# EasyEDA Pro project 万用表.eprj, schematic Schematic1_2

## Sheets
1 core: Board Name: 1.2版本-小表笔; Create Date: 2025-04-22; Page Name: core; Project Name: 天空星-简易数字万用表拓展版; Schematic Name: Schematic1_2; Update Date: 2025-04-22; Company: 嘉立创EDA; Page Size: A4; Version: V1.0
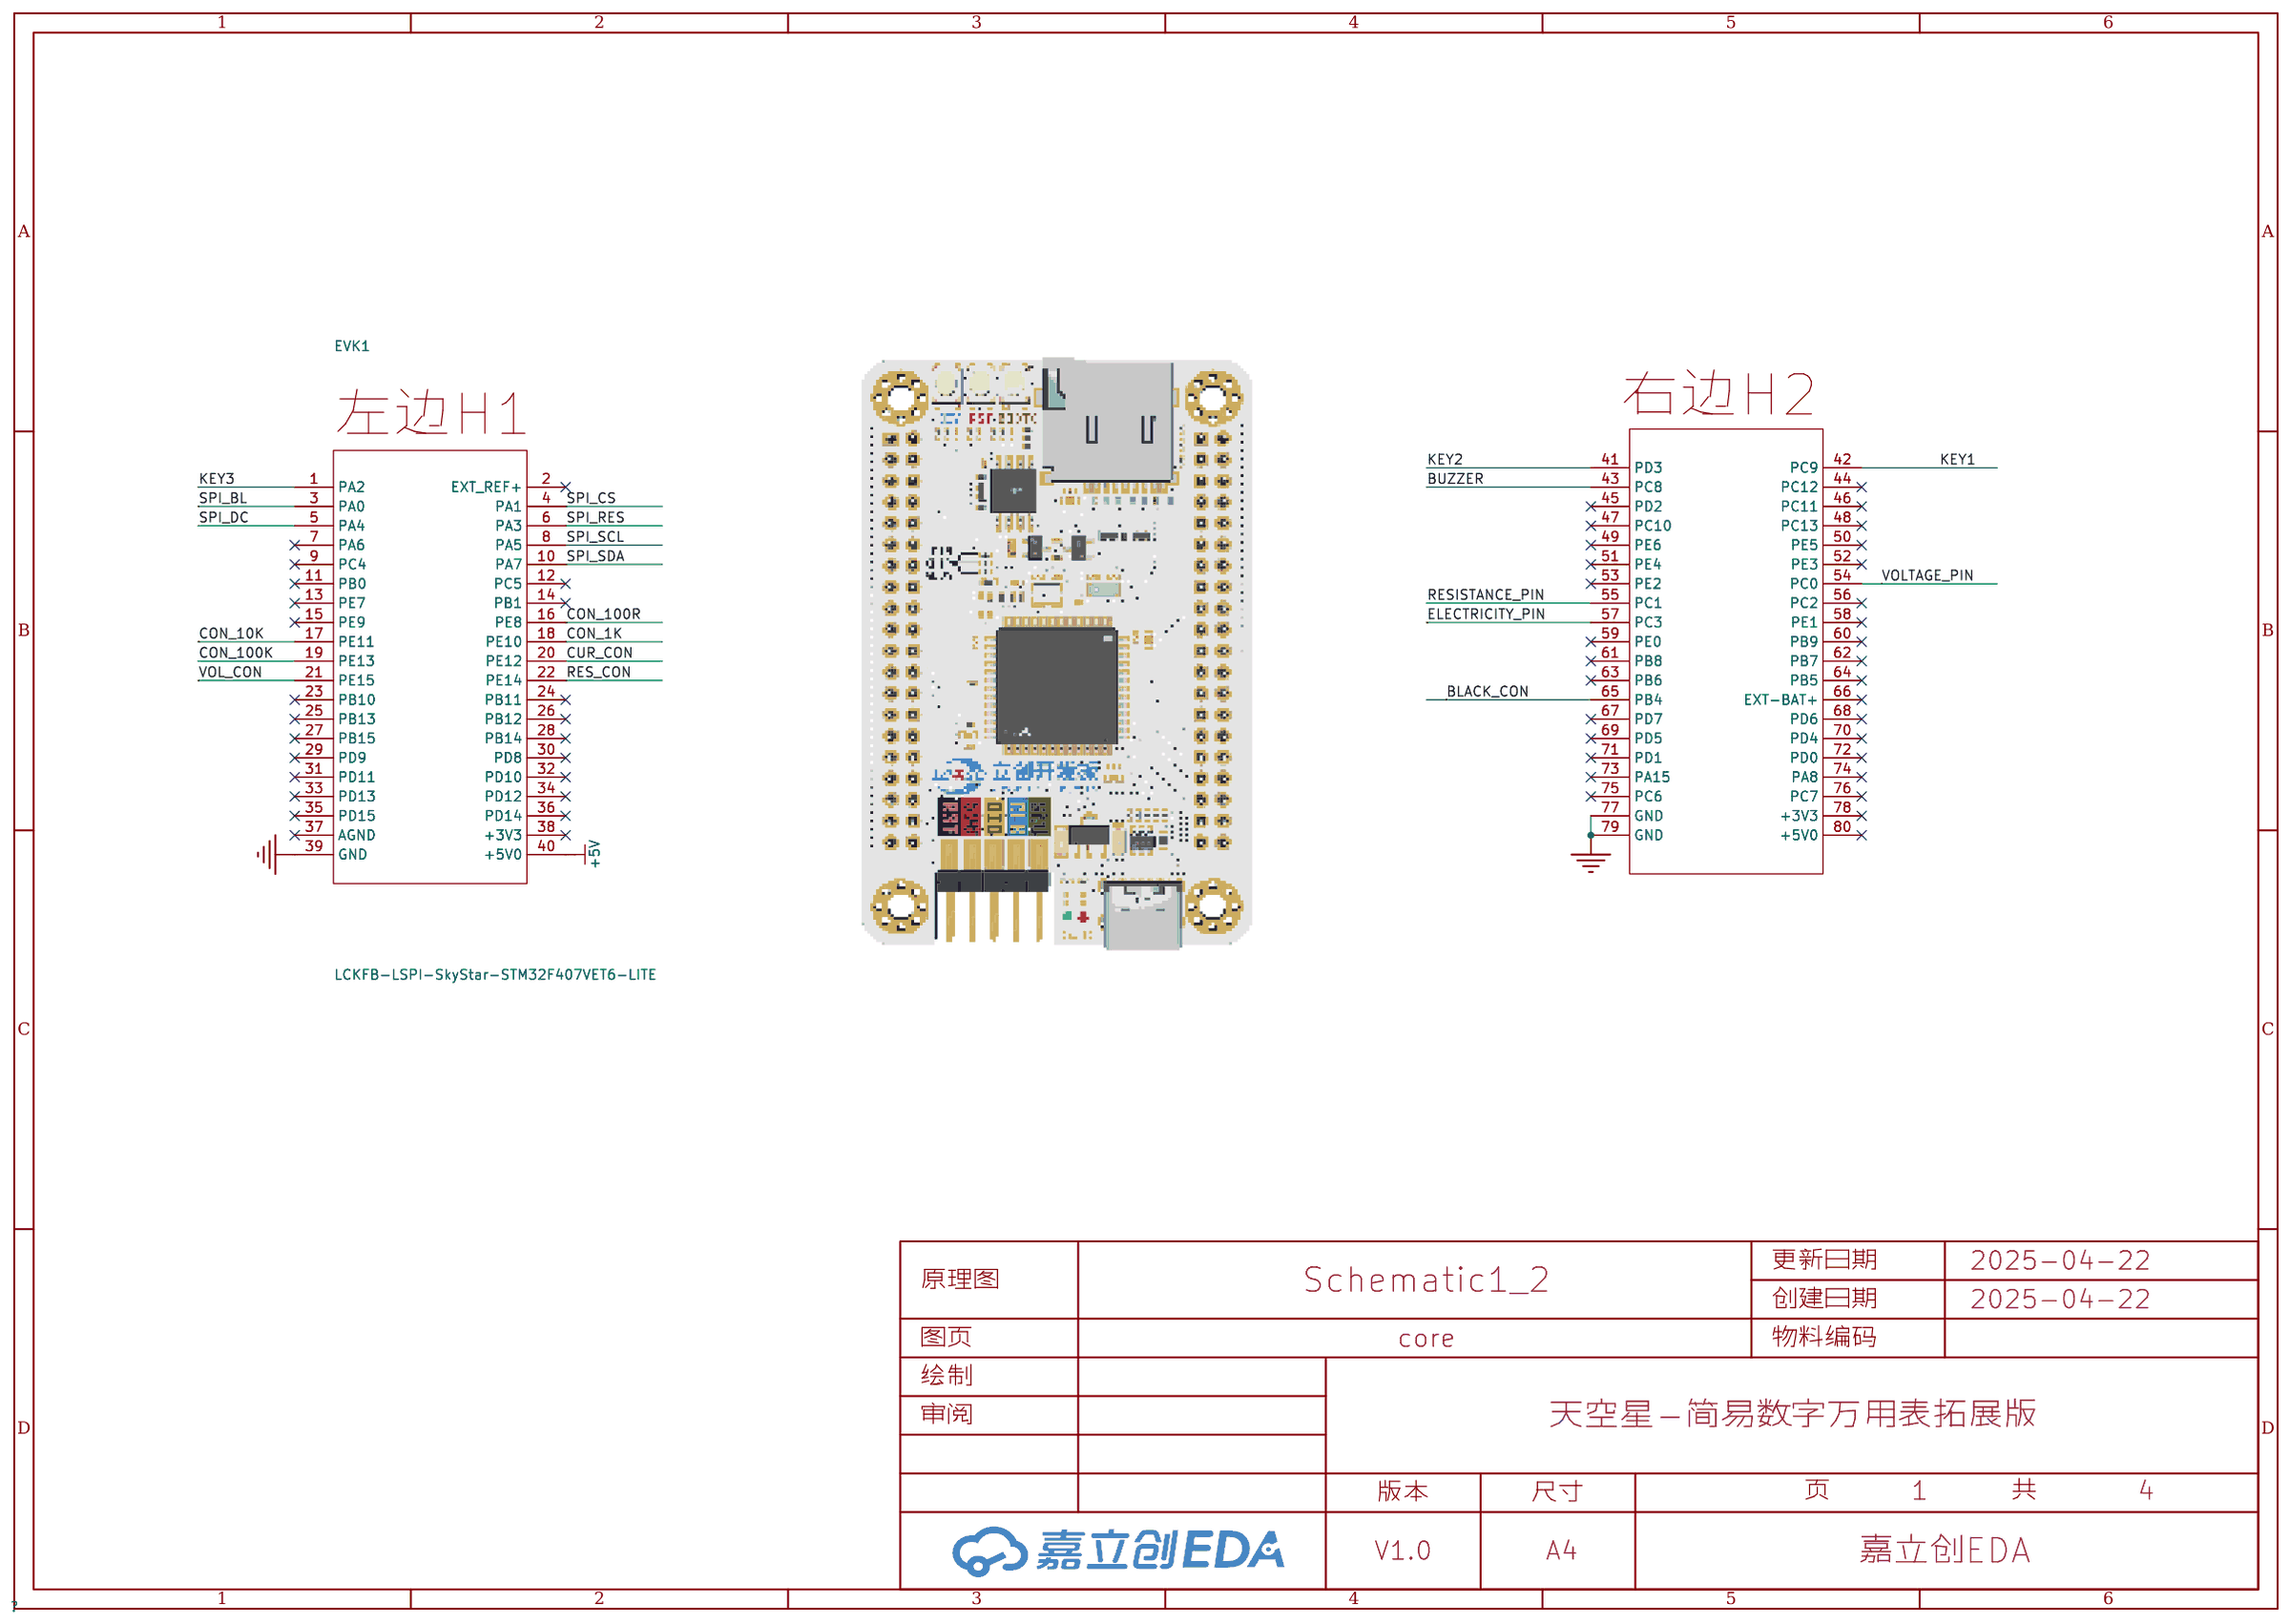
[diagram p4: core]
2 peripheral: Page Name: peripheral
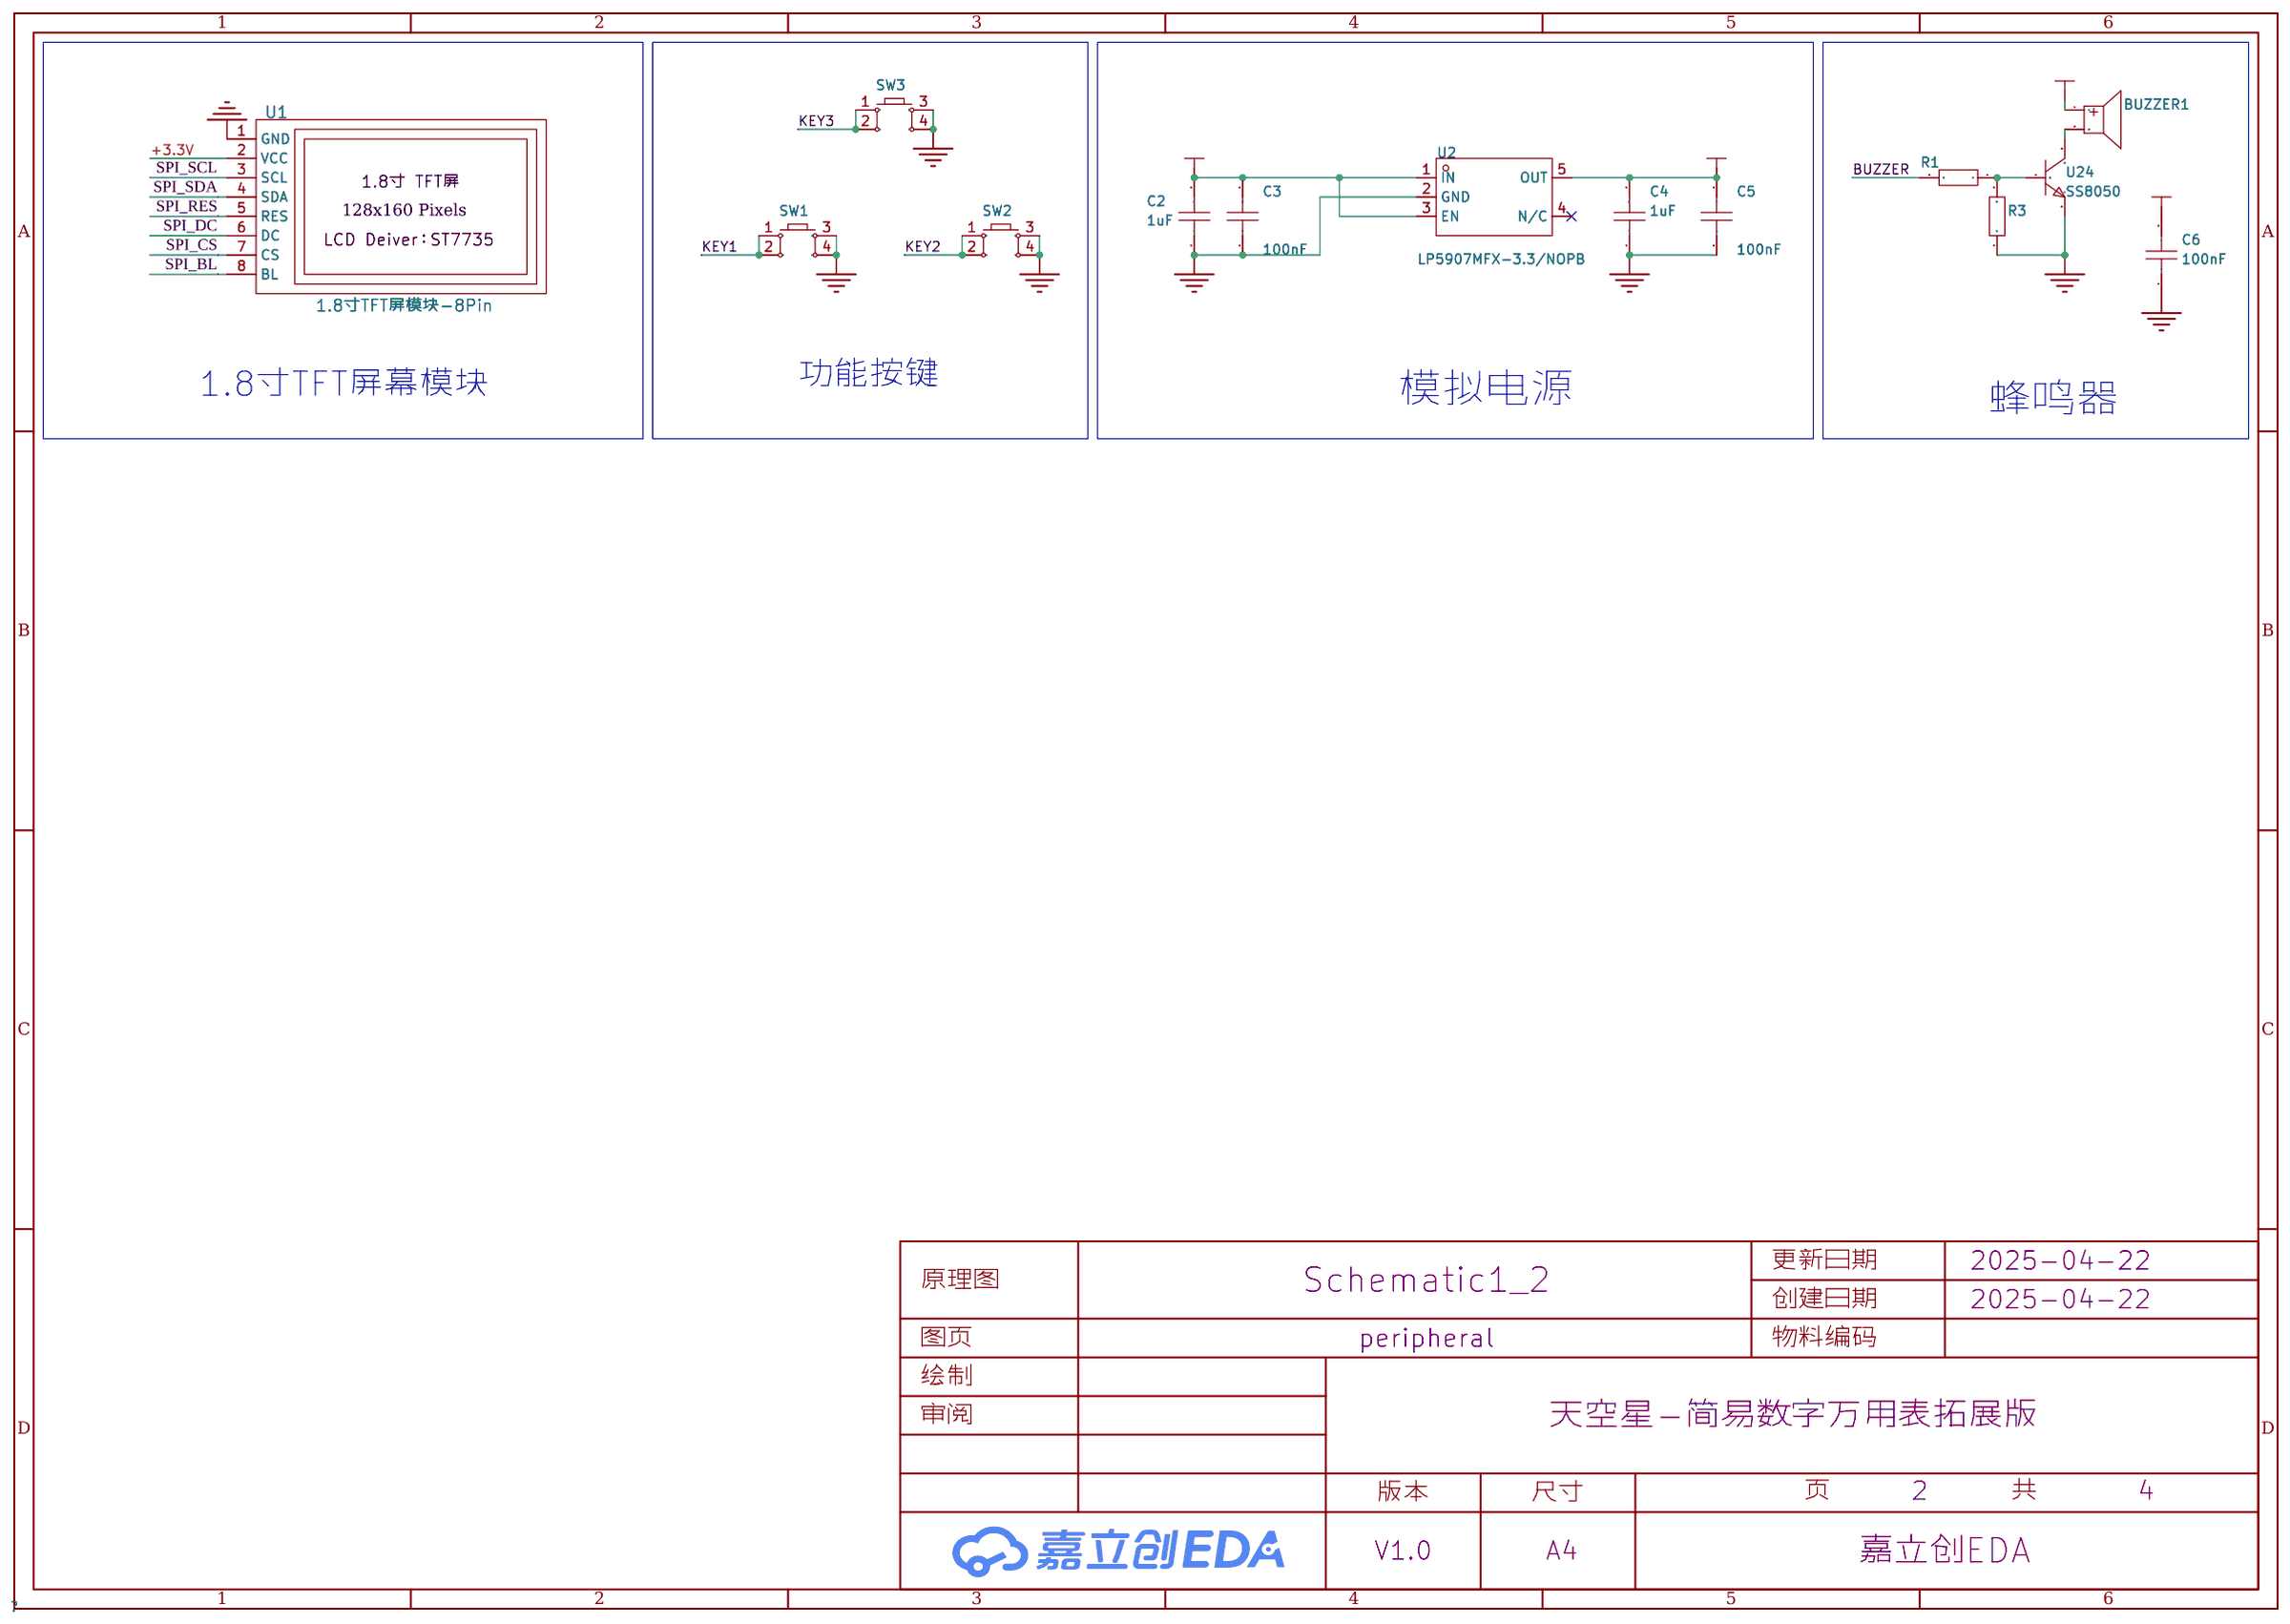
[diagram p5: peripheral]
3 control: Page Name: control
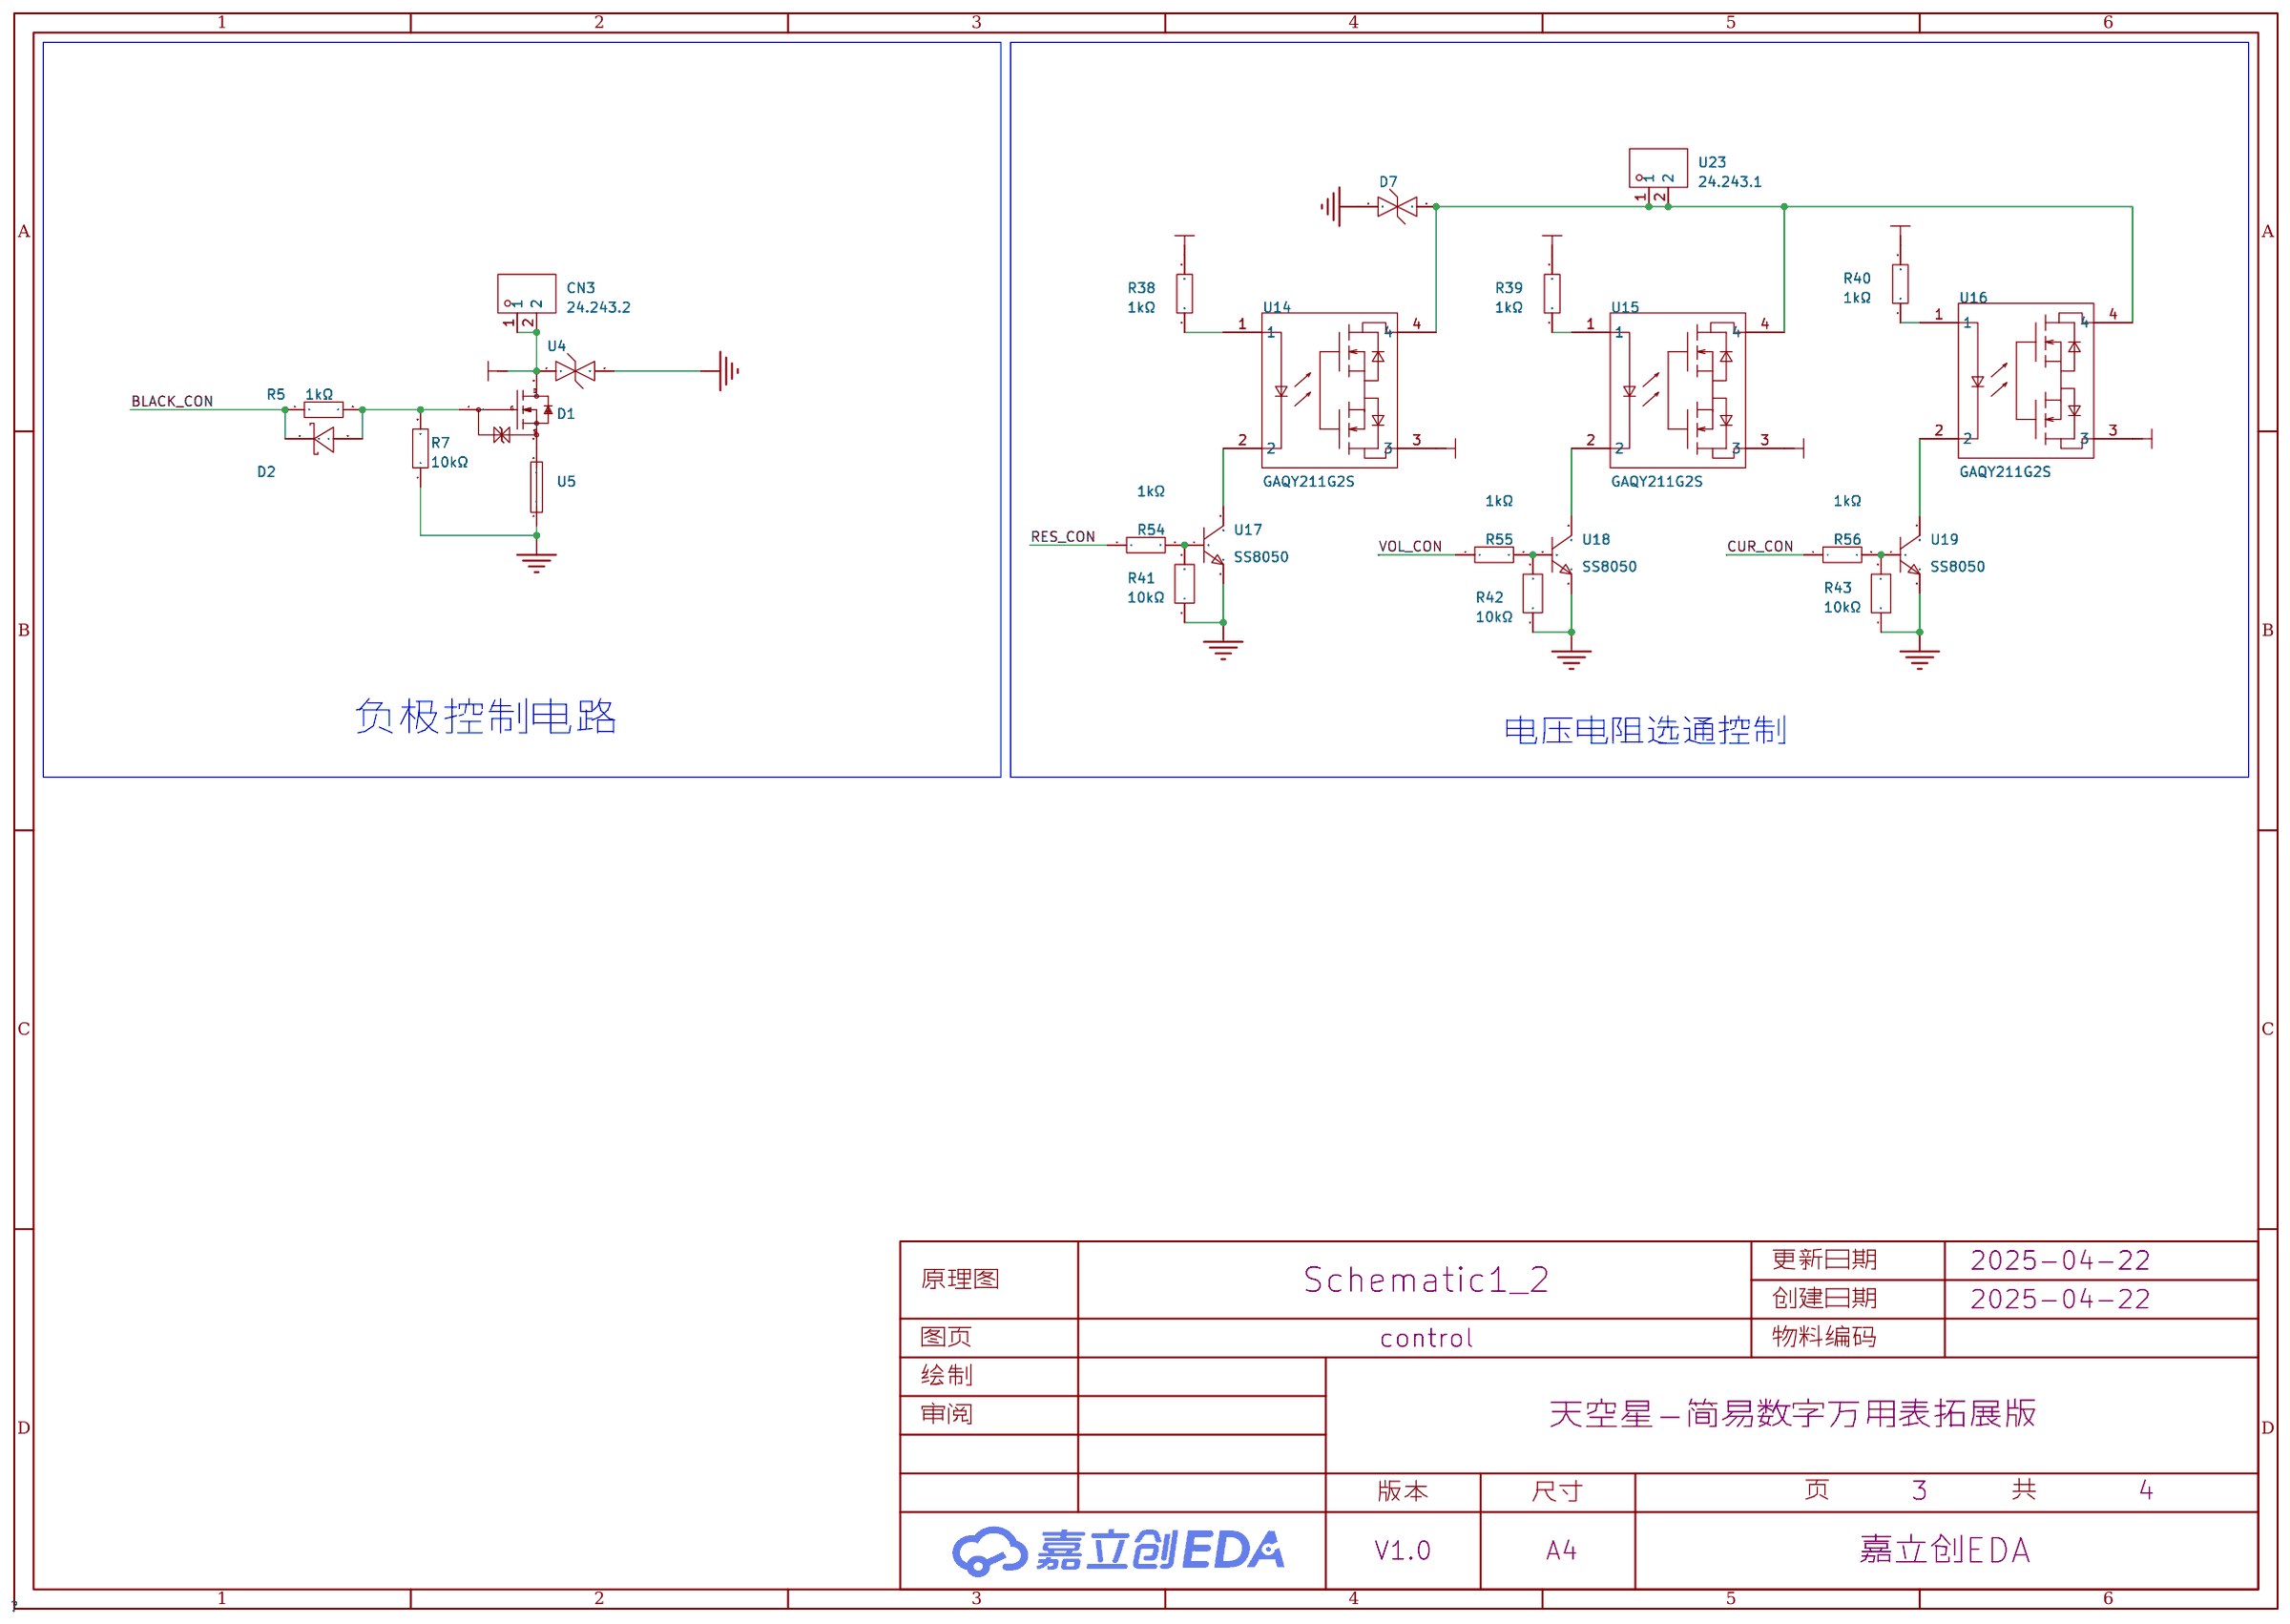
[diagram p6: control]
4 measure: Create Date: 2025-10-28; Page Name: measure; Project Name: 万用表; Update Date: 2025-10-28
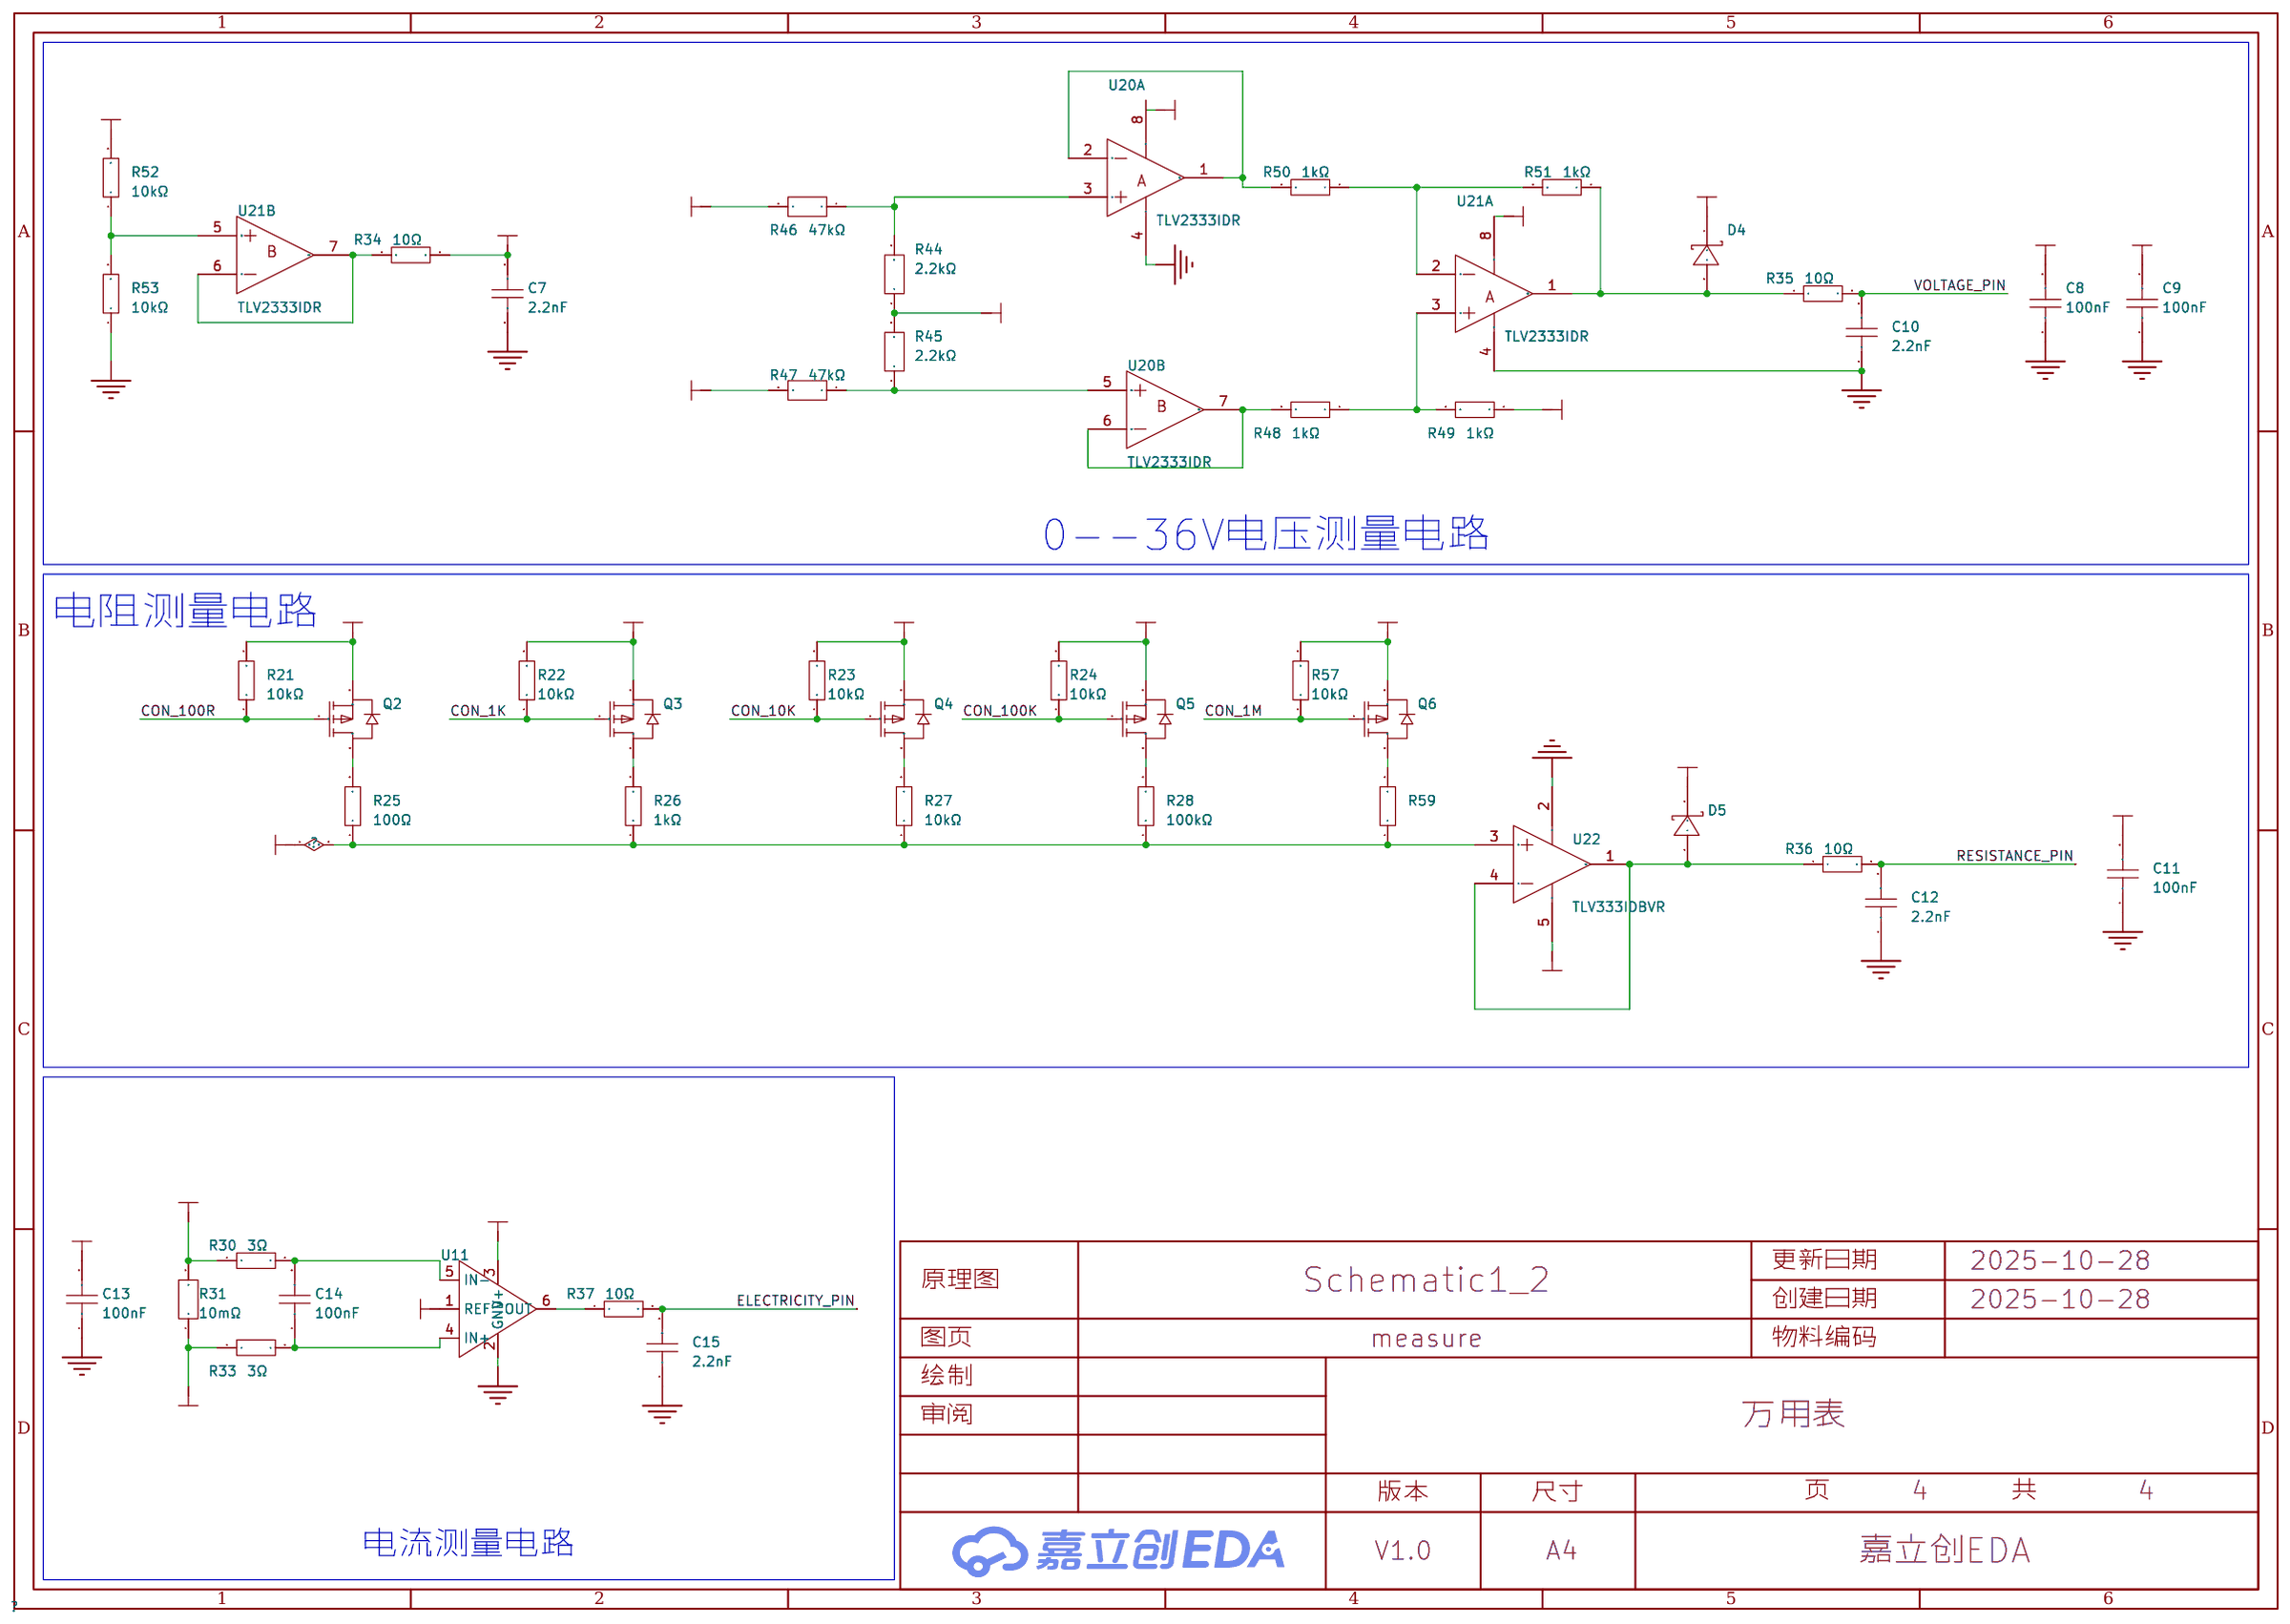
[diagram p7: measure]

## Parts
sheet control
CN3  24.243.2  [CONN-TH_24.243.2]
D1  SJD12C40L01  [SOD-123_L2.8-W1.8-LS3.7-BI]
D2  1N5819WS  [SOD-323_L1.8-W1.3-LS2.5-RD]
D7  SJD12C40L01  [SOD-123_L2.8-W1.8-LS3.7-BI]
R5  1kΩ  [R0603]
R7  10kΩ  [R0603]
R38  1kΩ  [R0603]
R39  1kΩ  [R0603]
R40  1kΩ  [R0603]
R41  10kΩ  [R0603]
R42  10kΩ  [R0603]
R43  10kΩ  [R0603]
R54  1kΩ  [R0603]
R55  1kΩ  [R0603]
R56  1kΩ  [R0603]
U4  2N7002K  [SOT-23-3_L2.9-W1.3-P1.90-LS2.4-BL-1]
U5  BSMD0603-010-36V  [F0603]
U14  GAQY211G2S  [SOP-4_L4.4-W4.0-P2.54-LS7.0-TL]
U15  GAQY211G2S  [SOP-4_L4.4-W4.0-P2.54-LS7.0-TL]
U16  GAQY211G2S  [SOP-4_L4.4-W4.0-P2.54-LS7.0-TL]
U17  SS8050  [SOT-23-3_L2.9-W1.3-P1.90-LS2.4-BR]
U18  SS8050  [SOT-23-3_L2.9-W1.3-P1.90-LS2.4-BR]
U19  SS8050  [SOT-23-3_L2.9-W1.3-P1.90-LS2.4-BR]
U23  24.243.1  [CONN-TH_24.243.1_RED]
sheet core
EVK1  LCKFB-LSPI-SkyStar-STM32F407VET6-LITE  [COMM-TH_LCKFB-LSPI-SKYSTAR-STM32F407VET6-LITE]
sheet measure
C7  2.2nF  [C0603]
C8  100nF  [C0603]
C9  100nF  [C0603]
C10  2.2nF  [C0603]
C11  100nF  [C0603]
C12  2.2nF  [C0603]
C13  100nF  [C0603]
C14  100nF  [C0603]
C15  2.2nF  [C0603]
D4  1N5819WS  [SOD-323_L1.8-W1.3-LS2.5-RD]
D5  1N5819WS  [SOD-323_L1.8-W1.3-LS2.5-RD]
Q2  AO3401  [SOT-23-3_L2.9-W1.4-P1.90-LS2.6-BR]
Q3  AO3401  [SOT-23-3_L2.9-W1.4-P1.90-LS2.6-BR]
Q4  AO3401  [SOT-23-3_L2.9-W1.4-P1.90-LS2.6-BR]
Q5  AO3401  [SOT-23-3_L2.9-W1.4-P1.90-LS2.6-BR]
Q6  AO3401  [SOT-23-3_L2.9-W1.4-P1.90-LS2.6-BR]
R21  10kΩ  [R0603]
R22  10kΩ  [R0603]
R23  10kΩ  [R0603]
R24  10kΩ  [R0603]
R25  100Ω  [R0603]
R26  1kΩ  [R0603]
R27  10kΩ  [R0603]
R28  100kΩ  [R0603]
R30  3Ω  [R0603]
R31  10mΩ  [RES-SMD_L6.4-W3.2-R2512]
R33  3Ω  [R0603]
R34  10Ω  [R0603]
R35  10Ω  [R0603]
R36  10Ω  [R0603]
R37  10Ω  [R0603]
R44  2.2kΩ  [R0603]
R45  2.2kΩ  [R0603]
R46  47kΩ  [R0603]
R47  47kΩ  [R0603]
R48  1kΩ  [R0603]
R49  1kΩ  [R0603]
R50  1kΩ  [R0603]
R51  1kΩ  [R0603]
R52  10kΩ  [R0603]
R53  10kΩ  [R0603]
R57  10kΩ  [R0603]
R59  1MΩ  [R0603]
U11  TP181A1-CR  [SC70-6_L2.1-W1.3-P0.65-LS2.3-BL]
U20  TLV2333IDR  [SOIC-8_L4.9-W3.9-P1.27-LS6.0-BL]  (sections 1,2)
U21  TLV2333IDR  [SOIC-8_L4.9-W3.9-P1.27-LS6.0-BL]  (sections 1,2)
U22  TLV333IDBVR  [SOT-23-5_L2.9-W1.6-P0.95-LS2.8-BL]
sheet peripheral
BUZZER1  3kHz  [BUZ-TH_BD9.0-P5.00-D0.6-FD]
C2  1uF  [C0603]
C3  100nF  [C0603]
C4  1uF  [C0603]
C5  100nF  [C0603]
C6  100nF  [C0603]
R1  10kΩ  [R0603]
R3  10kΩ  [R0603]
SW1  TS-1009S-03826  [SW-SMD_4P-L4.5-W4.5-P3.00-LS7.0_TS-1009S-03826]
SW2  TS-1009S-03826  [SW-SMD_4P-L4.5-W4.5-P3.00-LS7.0_TS-1009S-03826]
SW3  TS-1009S-03826  [SW-SMD_4P-L4.5-W4.5-P3.00-LS7.0_TS-1009S-03826]
U1  1.8寸TFT屏模块-8Pin  [1.8寸TFT屏模块-8PIN]
U2  LP5907MFX-3.3/NOPB  [SOT-23-5_L3.0-W1.7-P0.95-LS2.8-BR]
U24  SS8050  [SOT-23-3_L2.9-W1.3-P1.90-LS2.4-BR]

## Library data of the parts
CN3 = 24.243.2: Supplier Part: C7437322; Manufacturer: AMASS(艾迈斯); JLCPCB Part Class: 扩展库; Datasheet: https://atta.szlcsc.com/upload/public/pdf/source/20230721/37FAFEEF0E72AB9E7313F8A5C2400A2E.pdf; Supplier: LCSC
D1 D7 = SJD12C40L01: 极性:双向;反向截止电压(Vrwm):40V;最大钳位电压:64.5V;峰值脉冲电流(Ipp)@10/1000us:3.1A;击穿电压:44.4V;; LCSC Part Name: 双向ESD; Supplier Part: C313287; Manufacturer: Brightking(君耀电子); Supplier Footprint: SOD-123S; JLCPCB Part Class: 扩展库; Datasheet: https://atta.szlcsc.com/upload/public/pdf/source/20190308/C313298_C5F5DA7B871929800C41255070D52D63.pdf; Supplier: LCSC; polarity: 双向; Reverse Stand-Off Voltage (Vrwm): 40V; Maximum Clamping Voltage: 64.5V; Peak Pulse Current (Ipp)@10/1000us: 3.1A; Breakdown Voltage: 44.4V; Number of Lines: 单路; Type: ESD
D2 D4 D5 = 1N5819WS_C191023: 正向压降(Vf):600mV@1A;直流反向耐压(Vr):40V;平均整流电流(Io):1A;; LCSC Part Name: 电压:40V 电流:1A; Supplier Part: C191023; Manufacturer: Hottech(合科泰); Supplier Footprint: SOD-323; JLCPCB Part Class: 基础库; Datasheet: https://atta.szlcsc.com/upload/public/pdf/source/20220428/3CB86FD8D28D653594B4E35F9D5AEFD9.pdf; Supplier: LCSC; Forward Voltage (Vf@If): 600mV@1A; Reverse Voltage (Vr): 40V; Average Rectified Current (Io): 1A
R5 R38-R40 = 0603WAF1001T5E: 电阻类型:厚膜电阻;阻值:1kΩ;精度:±1%;功率:100mW;最大工作电压:75V;温度系数:±100ppm/℃;; LCSC Part Name: 1kΩ ±1% 100mW 厚膜电阻; Supplier Part: C21190; Manufacturer: UNI-ROYAL(厚声); Supplier Footprint: 0603; JLCPCB Part Class: Basic Part; Datasheet: https://atta.szlcsc.com/upload/public/pdf/source/20200306/C422600_1E6D84923E4A46A82E41ADD87F860B5C.pdf; Supplier: LCSC; Type: 厚膜电阻; Tolerance: ±1%; Power(Watts): 100mW; Overload Voltage (Max): 75V; Temperature Coefficient: ±100ppm/℃; Operating Temperature Range: -55℃~+155℃
R7 R21-R24 R57 = 0603WAF1002T5E: 电阻类型:厚膜电阻;阻值:10kΩ;精度:±1%;功率:100mW;最大工作电压:75V;温度系数:±100ppm/℃;; LCSC Part Name: 厚膜电阻 10kΩ ±1% 100mW; Supplier Part: C25804; Manufacturer: UNI-ROYAL(厚声); Supplier Footprint: 0603; JLCPCB Part Class: 基础库; Datasheet: https://atta.szlcsc.com/upload/public/pdf/source/20200306/C422600_1E6D84923E4A46A82E41ADD87F860B5C.pdf; Supplier: LCSC; Type: 厚膜电阻; Tolerance: ±1%; Power(Watts): 100mW; Overload Voltage (Max): 75V; Temperature Coefficient: ±100ppm/℃; Operating Temperature Range: -55℃~+155℃
R41-R43 = 0603WAF1002T5E: 电阻类型:厚膜电阻;阻值:10kΩ;精度:±1%;功率:100mW;最大工作电压:75V;温度系数:±100ppm/℃;; LCSC Part Name: 厚膜电阻 10kΩ ±1% 100mW; Supplier Part: C25804; Manufacturer: UNI-ROYAL(厚声); Supplier Footprint: 0603; JLCPCB Part Class: Basic Part; Datasheet: https://atta.szlcsc.com/upload/public/pdf/source/20200306/C422600_1E6D84923E4A46A82E41ADD87F860B5C.pdf; Supplier: LCSC; Type: 厚膜电阻; Tolerance: ±1%; Power(Watts): 100mW; Overload Voltage (Max): 75V; Temperature Coefficient: ±100ppm/℃; Operating Temperature Range: -55℃~+155℃
R54-R56 = RC0603FR-071KL: 电阻类型:厚膜电阻;阻值:1kΩ;精度:±1%;功率:100mW;最大工作电压:75V;温度系数:±100ppm/℃;; LCSC Part Name: 厚膜电阻 1kΩ ±1% 100mW; Supplier Part: C22548; Manufacturer: YAGEO(国巨); Supplier Footprint: 0603; JLCPCB Part Class: 扩展库; Datasheet: https://atta.szlcsc.com/upload/public/pdf/source/20180316/70C0E2BDAE7FCC62C531A5A58D202EE1.pdf; Supplier: LCSC; Type: 厚膜电阻; Tolerance: ±1%; Power(Watts): 100mW; Overload Voltage (Max): 75V; Temperature Coefficient: ±100ppm/℃; Operating Temperature Range: -55℃~+155℃
U4 = 2N7002K_C3008053: 类型:1个N沟道;漏源电压(Vdss):60V;连续漏极电流(Id):300mA;功率(Pd):350mW;导通电阻(RDS(on)@Vgs,Id):2.2Ω@10V,300mA;阈值电压(Vgs(th)@Id):1.6V@250uA;; LCSC Part Name: 1个N沟道 耐压:60V 电流:300mA; Supplier Part: C3008053; Manufacturer: MSKSEMI(美森科); Supplier Footprint: SOT-23; JLCPCB Part Class: Extended Part; Datasheet: https://atta.szlcsc.com/upload/public/pdf/source/20231010/5AB8D059FA255FE9F5E2F13E941A7E6F.pdf; Supplier: LCSC; Type: 1个N沟道; Drain Source Voltage (Vdss): 60V; Continuous Drain Current (Id): 300mA; Power Dissipation (Pd): 350mW; Drain Source On Resistance (RDS(on)@Vgs,Id): 2.2Ω@10V,300mA; Gate Threshold Voltage (Vgs(th)@Id): 1.6V@250uA; Total Gate Charge (Qg@Vgs): 3.7nC@10V; Input Capacitance (Ciss@Vds): 25.5pF@30V; Reverse Transfer Capacitance (Crss@Vds): 7.8pF@30V; Operating Temperature: -50℃~+150℃@(Tj)
U5 = BSMD0603-010-36V: 最大电压:36V;最大电流:40A;保持电流:100mA;跳闸电流:300mA;; LCSC Part Name: 36V 0.1A 0603自恢复; Supplier Part: C18377604; Manufacturer: BHFUSE(佰宏); Supplier Footprint: 0603; JLCPCB Part Class: 扩展库; Datasheet: https://atta.szlcsc.com/upload/public/pdf/source/20231016/7E77207D94D4ADACC402A52F6B671663.pdf; Supplier: LCSC; Operating Voltage (Max): 36V; Current Rating (Max): 40A; Hold Current: 100mA; Trip Current: 300mA; Power Dissipation: 500mW; Resistance - Initial (Ri) (Min): 900mΩ; Resistance - Post Trip (R1) (Max): 8Ω; Maximum Time to Trip: 600ms; Operating Temperature: -40℃~+85℃
U14-U16 = GAQY211G2S: 触点形式:-;适用负载类型:-;正向压降(Vf):1.2V;负载电压:40V;连续负载电流:2.5A;导通电阻:60mΩ;; LCSC Part Name: GAQY211G2S 1 Form A(SPST-NO) 负载电压:40V 连续负载电流:2.5A; Supplier Part: C7435104; Manufacturer: SUPSiC(国晶微半导体); Supplier Footprint: SOP-4; JLCPCB Part Class: 扩展库; Datasheet: https://atta.szlcsc.com/upload/public/pdf/source/20241011/4BAA9F2B28F4E3269CE00069A12AE23B.pdf; Supplier: LCSC; Input Forward Voltage: 1.2V; Voltage - Load: 40V; Continuous Load Current: 2.5A; On Resistance: 60mΩ; Isolation Voltage(rms): 2.5kV; Turn-on time: 800us; Turn-off time: 20us
U17-U19 U24 = SS8050_C7420370: 晶体管类型:NPN;集电极电流(Ic):1.5A;集射极击穿电压(Vceo):25V;耗散功率(Pd):300mW;直流电流增益(hFE):120@100mA,1.0V;; LCSC Part Name: H档 200-350; Supplier Part: C7420370; Manufacturer: 宏嘉诚; Supplier Footprint: SOT-23; JLCPCB Part Class: Extended Part; Datasheet: https://atta.szlcsc.com/upload/public/pdf/source/20250205/5DB94E86981B5B1A1866D18E379C0D4F.pdf; Supplier: LCSC; Transistor Type: NPN; Collector Current (Ic): 1.5A; Collector-Emitter Breakdown Voltage (Vceo): 25V; Power Dissipation (Pd): 300mW; DC Current Gain (hFE@Ic,Vce): 120@100mA,1.0V; Transition Frequency (fT): 100MHz; Collector Cut-Off Current (Icbo): 100nA; Collector-Emitter Saturation Voltage (VCE(sat)@Ic,Ib): 500mV@800mA,80mA; Operating Temperature: -55℃~+150℃; type: NPN; Current - Collector(Ic): 1.5A; Collector - Emitter Voltage VCEO: 25V; Pd - Power Dissipation: 300mW; DC Current Gain: 120@100mA,1.0V; Transition frequency(fT): 100MHz; Current - Collector Cutoff: 100nA; Vce Saturation(VCE(sat)): 500mV
U23 = 24.243.1: Supplier Part: C7437321; Manufacturer: AMASS(艾迈斯); JLCPCB Part Class: 扩展库; Datasheet: https://atta.szlcsc.com/upload/public/pdf/source/20230721/37FAFEEF0E72AB9E7313F8A5C2400A2E.pdf; Supplier: LCSC
EVK1 = LCKFB-LSPI-SkyStar-STM32F407VET6-LITE: 单板,不送排针; LCSC Part Name: 立创·天空星开发板-STM32F407VET6-青春版; Supplier Part: C22370035; Manufacturer: 立创开发板; JLCPCB Part Class: Extended Part; Datasheet: https://atta.szlcsc.com/upload/public/pdf/source/20241206/0691F39A1CCEC0DBD54409B5B1AC1616.pdf; Supplier: LCSC
C7 C10 C12 C15 = 0603B222K500NT: 容值:2.2nF;精度:±10%;额定电压:50V;温度系数:X7R;; LCSC Part Name: 2.2nF ±10% 50V; Supplier Part: C1604; Manufacturer: FH(风华); Supplier Footprint: 0603; JLCPCB Part Class: Basic Part; Datasheet: https://atta.szlcsc.com/upload/public/pdf/source/20200305/C486355_26A10D38EF8C2A5C37091D0039909270.pdf; Supplier: LCSC; Tolerance: ±10%; Voltage Rating: 50V; Temperature Coefficient: X7R
C3 C5 C6 C8 C9 C11 C13 C14 = CC0603KRX7R9BB104: 容值:100nF;精度:±10%;额定电压:50V;材质(温度系数):X7R;; LCSC Part Name: 100nF ±10% 50V; Supplier Part: C14663; Manufacturer: YAGEO(国巨); Supplier Footprint: 0603; JLCPCB Part Class: 基础库; Datasheet: https://atta.szlcsc.com/upload/public/pdf/source/20180910/C282072_33301C7F631E79921B82A8DAC6BCC5B3.pdf; Supplier: LCSC; Tolerance: ±10%; Voltage Rated: 50V; Temperature Coefficient: X7R
Q2-Q6 = AO3401_C727156: 类型:1个P沟道;漏源电压(Vdss):30V;连续漏极电流(Id):4.2A;功率(Pd):350mW;导通电阻(RDS(on)@Vgs,Id):65mΩ@10V,4.2A;阈值电压(Vgs(th)@Id):1.3V@250uA;; LCSC Part Name: 1个P沟道 耐压:30V 电流:4.2A; Supplier Part: C727156; Manufacturer: TWGMC(台湾迪嘉); Supplier Footprint: SOT-23; JLCPCB Part Class: 扩展库; Datasheet: https://atta.szlcsc.com/upload/public/pdf/source/20200827/C727156_6E081BBEEFBC6B8FEE164CB196B0AF30.pdf; Supplier: LCSC; Type: 1个P沟道; Drain Source Voltage (Vdss): 30V; Continuous Drain Current (Id): 4.2A; Power Dissipation (Pd): 350mW; Drain Source On Resistance (RDS(on)@Vgs,Id): 65mΩ@10V,4.2A; Gate Threshold Voltage (Vgs(th)@Id): 1.3V@250uA
R25 = RT0603BRD07100RL: 电阻类型:薄膜电阻;阻值:100Ω;精度:±0.1%;功率:100mW;最大工作电压:75V;温度系数:±25ppm/℃;; LCSC Part Name: 薄膜电阻 100Ω ±0.1% 100mW; Supplier Part: C122970; Manufacturer: YAGEO(国巨); Supplier Footprint: 0603; JLCPCB Part Class: 扩展库; Datasheet: https://atta.szlcsc.com/upload/public/pdf/source/20180716/C95646_694A11296E8D6C27B0592E54BC4097D1.pdf; Supplier: LCSC; Type: 薄膜电阻; Tolerance: ±0.1%; Power(Watts): 100mW; Overload Voltage (Max): 75V; Temperature Coefficient: ±25ppm/℃; Operating Temperature Range: -55℃~+155℃
R26 R48-R51 = RT0603BRD071KL: 电阻类型:薄膜电阻;阻值:1kΩ;精度:±0.1%;功率:100mW;最大工作电压:75V;温度系数:±25ppm/℃;; LCSC Part Name: 薄膜电阻 1kΩ ±0.1% 100mW; Supplier Part: C110776; Manufacturer: YAGEO(国巨); Supplier Footprint: 0603; JLCPCB Part Class: 扩展库; Datasheet: https://atta.szlcsc.com/upload/public/pdf/source/20170704/1499151282044.pdf; Supplier: LCSC; Type: 薄膜电阻; Tolerance: ±0.1%; Power(Watts): 100mW; Overload Voltage (Max): 75V; Temperature Coefficient: ±25ppm/℃; Operating Temperature Range: -55℃~+155℃
R27 R52 R53 = RT0603BRD0710KL: 电阻类型:薄膜电阻;阻值:10kΩ;精度:±0.1%;功率:100mW;最大工作电压:75V;温度系数:±25ppm/℃;; LCSC Part Name: 薄膜电阻 10kΩ ±0.1% 100mW; Supplier Part: C95204; Manufacturer: YAGEO(国巨); Supplier Footprint: 0603; JLCPCB Part Class: 扩展库; Datasheet: https://atta.szlcsc.com/upload/public/pdf/source/20170217/1487301593756.pdf; Supplier: LCSC; Type: 薄膜电阻; Tolerance: ±0.1%; Power(Watts): 100mW; Overload Voltage (Max): 75V; Temperature Coefficient: ±25ppm/℃; Operating Temperature Range: -55℃~+155℃
R28 = RT0603BRD07100KL: 电阻类型:薄膜电阻;阻值:100kΩ;精度:±0.1%;功率:100mW;最大工作电压:75V;温度系数:±25ppm/℃;; LCSC Part Name: 薄膜电阻 100kΩ ±0.1% 100mW; Supplier Part: C122538; Manufacturer: YAGEO(国巨); Supplier Footprint: 0603; JLCPCB Part Class: 扩展库; Datasheet: https://atta.szlcsc.com/upload/public/pdf/source/20170721/C122538_1500619326323834092.pdf; Supplier: LCSC; Type: 薄膜电阻; Tolerance: ±0.1%; Power(Watts): 100mW; Overload Voltage (Max): 75V; Temperature Coefficient: ±25ppm/℃; Operating Temperature Range: -55℃~+155℃
R30 R33 = RS-03L3R00FT: 电阻类型:厚膜电阻;阻值:3Ω;精度:±1%;功率:100mW;最大工作电压:50V;温度系数:±250ppm/℃;; LCSC Part Name: 厚膜电阻 3Ω ±1% 100mW; Supplier Part: C322143; Manufacturer: FH(风华); Supplier Footprint: 0603; JLCPCB Part Class: Extended Part; Datasheet: https://atta.szlcsc.com/upload/public/pdf/source/20140616/1457707091974.pdf; Supplier: LCSC; Type: 厚膜电阻; Tolerance: ±1%; Power(Watts): 100mW; Overload Voltage (Max): 50V; Temperature Coefficient: ±250ppm/℃; Operating Temperature Range: -55℃~+155℃
R31 = HoJLR2512-3W-10mR-1%: 电阻类型:采样电阻;阻值:10mΩ;精度:±1%;功率:3W;安装方式:贴片;; LCSC Part Name: 10mΩ ±1% 3W; Supplier Part: C2903468; Manufacturer: Milliohm(毫欧); Supplier Footprint: 2512; JLCPCB Part Class: 扩展库; Datasheet: https://atta.szlcsc.com/upload/public/pdf/source/20211009/7525CABAB363C979E942C1DD41F1FEF0.pdf; Supplier: LCSC; Type: 采样电阻; Tolerance: ±1%; Power(Watts): 3W; Mounting Sytle: 贴片
R34-R37 = 0603WAF100JT5E: 电阻类型:厚膜电阻;阻值:10Ω;精度:±1%;功率:100mW;最大工作电压:75V;温度系数:±400ppm/℃;; LCSC Part Name: 10Ω ±1% 100mW 厚膜电阻; Supplier Part: C22859; Manufacturer: UNI-ROYAL(厚声); Supplier Footprint: 0603; JLCPCB Part Class: 基础库; Datasheet: https://atta.szlcsc.com/upload/public/pdf/source/20200306/C422600_1E6D84923E4A46A82E41ADD87F860B5C.pdf; Supplier: LCSC; Type: 厚膜电阻; Tolerance: ±1%; Power(Watts): 100mW; Overload Voltage (Max): 75V; Temperature Coefficient: ±400ppm/℃; Operating Temperature Range: -55℃~+155℃
R44 R45 = RT0603BRD072K2L: 电阻类型:薄膜电阻;阻值:2.2kΩ;精度:±0.1%;功率:100mW;最大工作电压:75V;温度系数:±25ppm/℃;; LCSC Part Name: 薄膜电阻 2.2kΩ ±0.1% 100mW; Supplier Part: C861295; Manufacturer: YAGEO(国巨); Supplier Footprint: 0603; JLCPCB Part Class: 扩展库; Datasheet: https://atta.szlcsc.com/upload/public/pdf/source/20200610/C326738_5639A9F1B6EB6E4AE2197577D3456E7F.pdf; Supplier: LCSC; Type: 薄膜电阻; Tolerance: ±0.1%; Power(Watts): 100mW; Overload Voltage (Max): 75V; Temperature Coefficient: ±25ppm/℃; Operating Temperature Range: -55℃~+155℃
R46 R47 = RT0603BRD0747KL: 电阻类型:薄膜电阻;阻值:47kΩ;精度:±0.1%;功率:100mW;最大工作电压:75V;温度系数:±25ppm/℃;; LCSC Part Name: 薄膜电阻 47kΩ ±0.1% 100mW; Supplier Part: C326725; Manufacturer: YAGEO(国巨); Supplier Footprint: 0603; JLCPCB Part Class: 扩展库; Datasheet: https://atta.szlcsc.com/upload/public/pdf/source/20200819/C326725_13B149E3BCAC1A7F719E488E0C8D044E.pdf; Supplier: LCSC; Type: 薄膜电阻; Tolerance: ±0.1%; Power(Watts): 100mW; Overload Voltage (Max): 75V; Temperature Coefficient: ±25ppm/℃; Operating Temperature Range: -55℃~+155℃
R59 = RT0603BRD071ML: LCSC Part Name: 薄膜电阻 1MΩ ±0.1% 100mW; Supplier Part: C326730; Manufacturer: YAGEO(国巨); Supplier Footprint: 0603; Datasheet: https://atta.szlcsc.com/upload/public/pdf/source/20181031/C326730_38CB34937BF84E118CC2FDDFD1DCDFCC.pdf; Supplier: LCSC; Type: 薄膜电阻; Tolerance: ±0.1%; Power(Watts): 100mW; Overload Voltage (Max): 75V; Temperature Coefficient: ±25ppm/℃; Operating Temperature Range: -55℃~+155℃
U11 = TP181A1-CR: Supplier Part: C2902349; Manufacturer: 3PEAK(思瑞浦); Supplier Footprint: SC70-6; JLCPCB Part Class: Extended Part; Datasheet: https://atta.szlcsc.com/upload/public/pdf/source/20230301/6D62DABF8769A8088870FFE026FF2C6D.pdf; Supplier: LCSC
U20 U21 = TLV2333IDR: 放大器数:双路;增益带宽积(GBP):350kHz;输入偏置电流(Ib):70pA;输入失调电压(Vos):2uV;压摆率(SR):0.16V/us;轨到轨:-;; Supplier Part: C176649; Manufacturer: TI(德州仪器); Supplier Footprint: SOIC-8; JLCPCB Part Class: 扩展库; Datasheet: https://www.ti.com/cn/lit/gpn/tlv2333; Supplier: LCSC; Number of Circuits: 双路; Gain Bandwidth Product(GBP): 350kHz; Current - Input Bias(Ib): 70pA; Voltage - Input Offset(Vos): 2uV; Slew Rate(SR): 0.16V/us; Operating Temperature: -40℃~+125℃
U22 = TLV333IDBVR: 放大器数:单路;增益带宽积(GBP):350kHz;输入偏置电流(Ib):70pA;输入失调电压(Vos):2uV;压摆率(SR):0.16V/us;轨到轨:-;; Supplier Part: C473369; Manufacturer: TI(德州仪器); Supplier Footprint: SOT-23-5; JLCPCB Part Class: 扩展库; Datasheet: https://www.ti.com/cn/lit/gpn/tlv333; Supplier: LCSC; Number of Circuits: 单路; Gain Bandwidth Product(GBP): 350kHz; Current - Input Bias(Ib): 70pA; Voltage - Input Offset(Vos): 2uV; Slew Rate(SR): 0.16V/us; Operating Temperature: -40℃~+125℃
BUZZER1 = HNB09A03: 驱动方式:有源(内含驱动线路);构造类型:电磁式;额定电压:3V;工作电压:1.5V~4.5V;消耗电流:30mA;频率:3kHz;声压(SPL):85dB@10cm;直径(φD):9mm;长度:-;宽度:-;高度:5.5mm;工作温度:-20℃~+70℃;; LCSC Part Name: 电磁式有源一体蜂鸣器HNB09A03; Supplier Part: C96102; Manufacturer: 华能; Supplier Footprint: 插件,D=9mm; Datasheet: https://atta.szlcsc.com/upload/public/pdf/source/20170522/1495448326172.pdf; Supplier: LCSC; Oscillator Circuit: 有源(内含驱动线路); Technology Type: 电磁式; Rated Voltage: 3V; Operating Voltage: 1.5V~4.5V; Current Consumption: 30mA; Sound Pressure Level (SPL): 85dB@10cm; Diameter (φD): 9mm; Height: 5.5mm; Operating Temperature: -20℃~+70℃
C2 C4 = CL10A105KB8NNNC: 容值:1uF;精度:±10%;额定电压:50V;材质(温度系数):X5R;; LCSC Part Name: 1uF ±10% 50V; Supplier Part: C15849; Manufacturer: SAMSUNG(三星); Supplier Footprint: 0603; JLCPCB Part Class: 基础库; Datasheet: https://atta.szlcsc.com/upload/public/pdf/source/20160218/1457707763339.pdf; Supplier: LCSC; Tolerance: ±10%; Voltage Rated: 50V; Temperature Coefficient: X5R
R1 R3 = 0603WAF1002T5E: 电阻类型:厚膜电阻;阻值:10kΩ;精度:±1%;功率:100mW;; LCSC Part Name: 厚膜电阻 10kΩ ±1% 100mW; Supplier Part: C25804; Manufacturer: UNI-ROYAL(厚声); Supplier Footprint: 0603; JLCPCB Part Class: 基础库; Datasheet: https://atta.szlcsc.com/upload/public/pdf/source/20200306/C422600_1E6D84923E4A46A82E41ADD87F860B5C.pdf; Supplier: LCSC; Type: 厚膜电阻; Tolerance: ±1%; Power(Watts): 100mW; Overload Voltage (Max): 75V; Temperature Coefficient: ±100ppm/℃; Operating Temperature Range: -55℃~+155℃
SW1-SW3 = TS-1009S-03826: 电路结构:单刀单掷;按钮形状:圆形按钮;安装方式:立贴;开关长度:4.5mm;开关宽度:4.5mm;开关高度:3.8mm;触点电流:50mA;额定电压(DC):12V;带灯:-;机械寿命:-;; LCSC Part Name: 4.5*4.5*3.8mm 立贴 轻触开关; Supplier Part: C455243; Manufacturer: XUNPU(讯普); Supplier Footprint: SMD,4.5x4.5mm; JLCPCB Part Class: Extended Part; Datasheet: https://atta.szlcsc.com/upload/public/pdf/source/20191118/C455248_D35D7E271EC7BD44939E7F982BCB1632.pdf; Supplier: LCSC; Circuit: 单刀单掷; Actuator Style: 圆形按钮; Mounting Style: 立贴; Switch Length: 4.5mm; Switch Width: 4.5mm; Switch Height: 3.8mm; Contact Current: 50mA; Voltage Rating (DC): 12V
U1 = 1.8寸TFT屏模块-8Pin: Supplier Part: C2897371; Supplier: 立创商城; Check: false
U2 = LP5907MFX-3.3/NOPB: 输出类型:固定;最大输入电压:5.5V;输出电压:3.3V;输出电流:250mA;电源纹波抑制比(PSRR):90dB@(100Hz)；60dB@(100kHz);输出极性:正极;; LCSC Part Name: 具有低 IQ 和使能功能的 250mA、低噪声、高 PSRR、超低压降稳压器; Supplier Part: C80670; Manufacturer: TI(德州仪器); Supplier Footprint: SOT-23-5; JLCPCB Part Class: 扩展库; Datasheet: https://www.ti.com/cn/lit/gpn/lp5907; Supplier: LCSC; Output Type: 固定; Maximum Input Voltage: 5.5V; Output Voltage: 3.3V; Output Current: 250mA; Power Supply Rejection Ratio (PSRR): 90dB@(100Hz)；60dB@(100kHz); Dropout Voltage: 250mV@(250mA); standby current: 25uA; Feature: 防静电保护；短路保护；自动放电功能；低ESR；热保护(TSD)；欠压闭锁；带使能; Operating Temperature: -40℃~+125℃; Output Polarity: 正极; Number of Outputs: 1

## Nets
+3.3V: BUZZER1.1 C4.2 C5.2 C6.2 C8.2 C9.2 C11.2 C13.2 D4.1(K) D5.1(K) Q2.2(S) Q3.2(S) Q4.2(S) Q5.2(S) Q6.2(S) R21.2 R22.2 R23.2 R24.2 R38.2 R39.2 R40.2 R52.2 R57.2 U1.2(VCC) U2.5(OUT) U11.3(V+) U20.8(V+) U21.8(V+) U22.5(V+)
+5V: C2.2 C3.2 EVK1.40(+5V0) U2.1(IN) U2.3(EN)
GND: C2.1 C3.1 C4.1 C5.1 C6.1 C7.1 C8.1 C9.1 C10.1 C11.1 C12.1 C13.1 C15.1 D1.2 D7.1 EVK1.39(GND) EVK1.77(GND) EVK1.79(GND) R3.1 R7.1 R41.1 R42.1 R43.1 R53.1 SW1.3 SW1.4 SW2.3 SW2.4 SW3.3 SW3.4 U1.1(GND) U2.2(GND) U5.1 U11.2(GND) U17.2(E) U18.2(E) U19.2(E) U20.4(V-) U21.4(V-) U22.2(V-) U24.2(E)
BLACK_CON: D2.1(K) EVK1.65(PB4) R5.1
BLACK_PIN: CN3.1 CN3.2 D1.1 R30.1 R31.2 R46.2 U4.3(D)
BUZZER: EVK1.43(PC8) R1.2
CON_1K: EVK1.18(PE10) Q3.1(G) R22.1
CON_1M: Q6.1(G) R57.1
CON_10K: EVK1.17(PE11) Q4.1(G) R23.1
CON_100K: EVK1.19(PE13) Q5.1(G) R24.1
CON_100R: EVK1.16(PE8) Q2.1(G) R21.1
CUR_CON: EVK1.20(PE12) R56.1
CUR_VCC: R31.1 R33.1 U16.3
ELECTRICITY_PIN: C15.2 EVK1.57(PC3) R37.2
KEY1: EVK1.42(PC9) SW1.1 SW1.2
KEY2: EVK1.41(PD3) SW2.1 SW2.2
KEY3: EVK1.1(PA2) SW3.1 SW3.2
RES_CON: EVK1.22(PE14) R54.1
RES_VCC: R25.1 R26.1 R27.1 R28.1 R59.1 U14.3 U22.3(IN+)
RESISTANCE_PIN: C12.2 EVK1.55(PC1) R36.2
SPI_BL: EVK1.3(PA0) U1.8(BL)
SPI_CS: EVK1.4(PA1) U1.7(CS)
SPI_DC: EVK1.5(PA4) U1.6(DC)
SPI_RES: EVK1.6(PA3) U1.5(RES)
SPI_SCL: EVK1.8(PA5) U1.3(SCL)
SPI_SDA: EVK1.10(PA7) U1.4(SDA)
VOL_CON: EVK1.21(PE15) R55.1
VOL_VCC: R47.2 U15.3
VOLTAGE_PIN: C10.2 EVK1.54(PC0) R35.2
VREF: C7.2 R34.2 R44.1 R45.2 R49.1 U11.1(REF)
$2N837: R1.1 R3.2 U24.1(B)
$2N838: BUZZER1.2 U24.3(C)
$3N410: D2.2(A) R5.2 R7.2 U4.1(G)
$3N411: U4.2(S) U5.2
$3N4308: D7.2 U14.4 U15.4 U16.4 U23.1 U23.2
$3N4546: R38.1 U14.1
$3N4550: R39.1 U15.1
$3N4555: R40.1 U16.1
$3N5537: U14.2 U17.3(C)
$3N5732: U15.2 U18.3(C)
$3N5836: U16.2 U19.3(C)
$3N10755: R41.2 R54.2 U17.1(B)
$3N10799: R42.2 R55.2 U18.1(B)
$3N10842: R43.2 R56.2 U19.1(B)
$4N965: R44.2 R46.1 U20.3(INA+)
$4N967: R45.1 R47.1 U20.5(INB+)
$4N972: R50.2 U20.1(OUTA) U20.2(INA-)
$4N973: R50.1 R51.2 U21.2(INA-)
$4N974: R48.1 R49.2 U21.3(INA+)
$4N985: R52.1 R53.2 U21.5(INB+)
$4N994: D4.2(A) R35.1 R51.1 U21.1(OUTA)
$4N1465: C14.1 R33.2 U11.4(IN+)
$4N1467: C14.2 R30.2 U11.5(IN-)
$4N1481: R37.1 U11.6(OUT)
$4N2338: Q2.3(D) R25.2
$4N2342: Q3.3(D) R26.2
$4N2344: Q4.3(D) R27.2
$4N2348: Q5.3(D) R28.2
$4N2381: D5.2(A) R36.1 U22.1(OUT) U22.4(IN-)
$4N19267: R34.1 U21.6(INB-) U21.7(OUTB)
$4N19289: R48.2 U20.6(INB-) U20.7(OUTB)
Net-(Q6-3): Q6.3(D) R59.2

Not connected (* = marked no-connect by the designer): EVK1 2(EXT REF+)* 7(PA6)* 9(PC4)* 11(PB0)* 12(PC5)* 13(PE7)* 14(PB1)* 15(PE9)* 23(PB10)* 24(PB11)* 25(PB13)* 26(PB12)* 27(PB15)* 28(PB14)* 29(PD9)* 30(PD8)* 31(PD11)* 32(PD10)* 33(PD13)* 34(PD12)* 35(PD15)* 36(PD14)* 37(AGND)* 38(+3V3)* 44(PC12)* 45(PD2)* 46(PC11)* 47(PC10)* 48(PC13)* 49(PE6)* 50(PE5)* 51(PE4)* 52(PE3)* 53(PE2)* 56(PC2)* 58(PE1)* 59(PE0)* 60(PB9)* 61(PB8)* 62(PB7)* 63(PB6)* 64(PB5)* 66(EXT-BAT+)* 67(PD7)* 68(PD6)* 69(PD5)* 70(PD4)* 71(PD1)* 72(PD0)* 73(PA15)* 74(PA8)* 75(PC6)* 76(PC7)* 78(+3V3)* 80(+5V0)*; U2 4(N/C)*

## Notes on the sheets
sheet 2
- 1.8寸TFT屏幕模块
- 功能按键
- 模拟电源
- 蜂鸣器
sheet 3
- 负极控制电路
- 电压电阻选通控制
sheet 4
- 0--36V电压测量电路
- 电阻测量电路
- 电流测量电路
